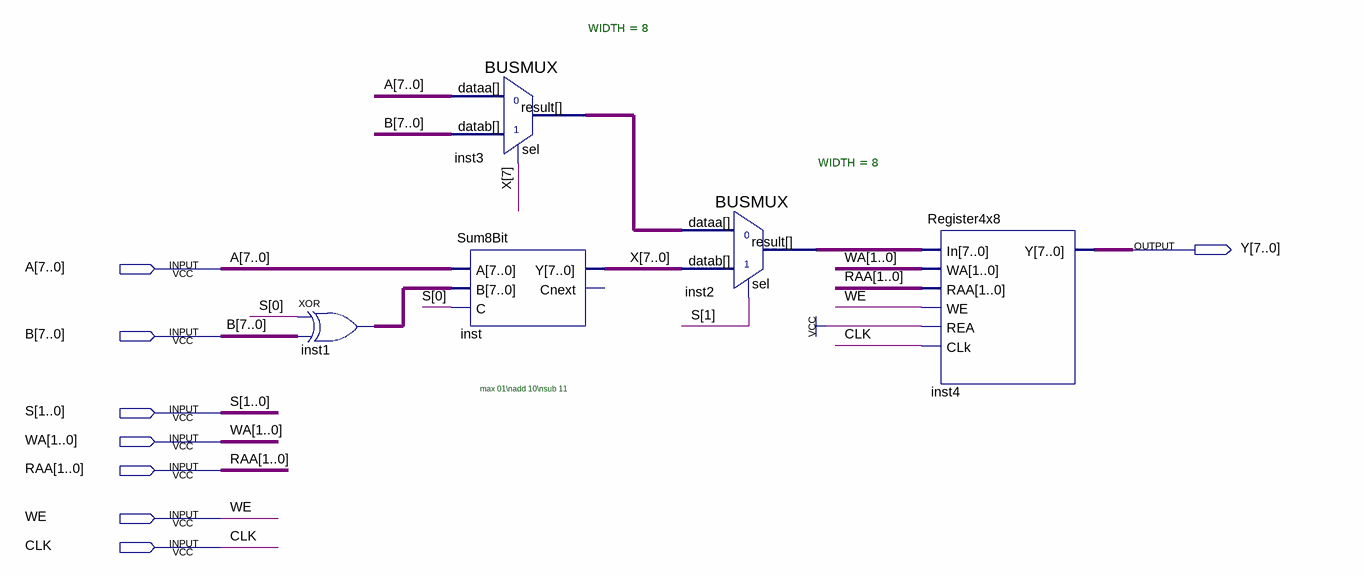
[diagram p0: schematic sheet]
// Quartus schematic AU2.bdf as structural Verilog: 5 symbols, 8 pins
module AU2 (
  input  [7:0] A,
  input  [7:0] B,
  input  [1:0] S,
  input  [1:0] WA,
  input  [1:0] RAA,
  input  WE,
  input  CLK,
  output [7:0] Y
);

  wire [7:0] inst1_out, inst2_result, inst3_result, X;

  assign inst1_out = {8{S[0]}} ^ B;  // XOR inst1, 8 bits wide
  BUSMUX #(.WIDTH(8)) inst3 (.datab(B), .sel(X[7]), .dataa(A), .result(inst3_result));
  Sum8Bit inst (.A(A), .B(inst1_out), .C(S[0]), .Y(X));  // open: Cnext
  BUSMUX #(.WIDTH(8)) inst2 (.datab(X), .sel(S[1]), .dataa(inst3_result), .result(inst2_result));
  Register4x8 inst4 (.In(inst2_result), .WA(WA), .RAA(RAA), .WE(WE), .REA(1'b1), .CLk(CLK), .Y(Y));

  // Notes on the sheet:
  //   max 01\nadd 10\nsub 11
endmodule
